# Altium schematic sheet AMP_V1.1.SchDoc
size A3; Organization: Altium Limited; Address1: L3, 12a Rodborough Rd; Address2: Frenchs Forest; Address3: NSW; Address4: Australia 2086
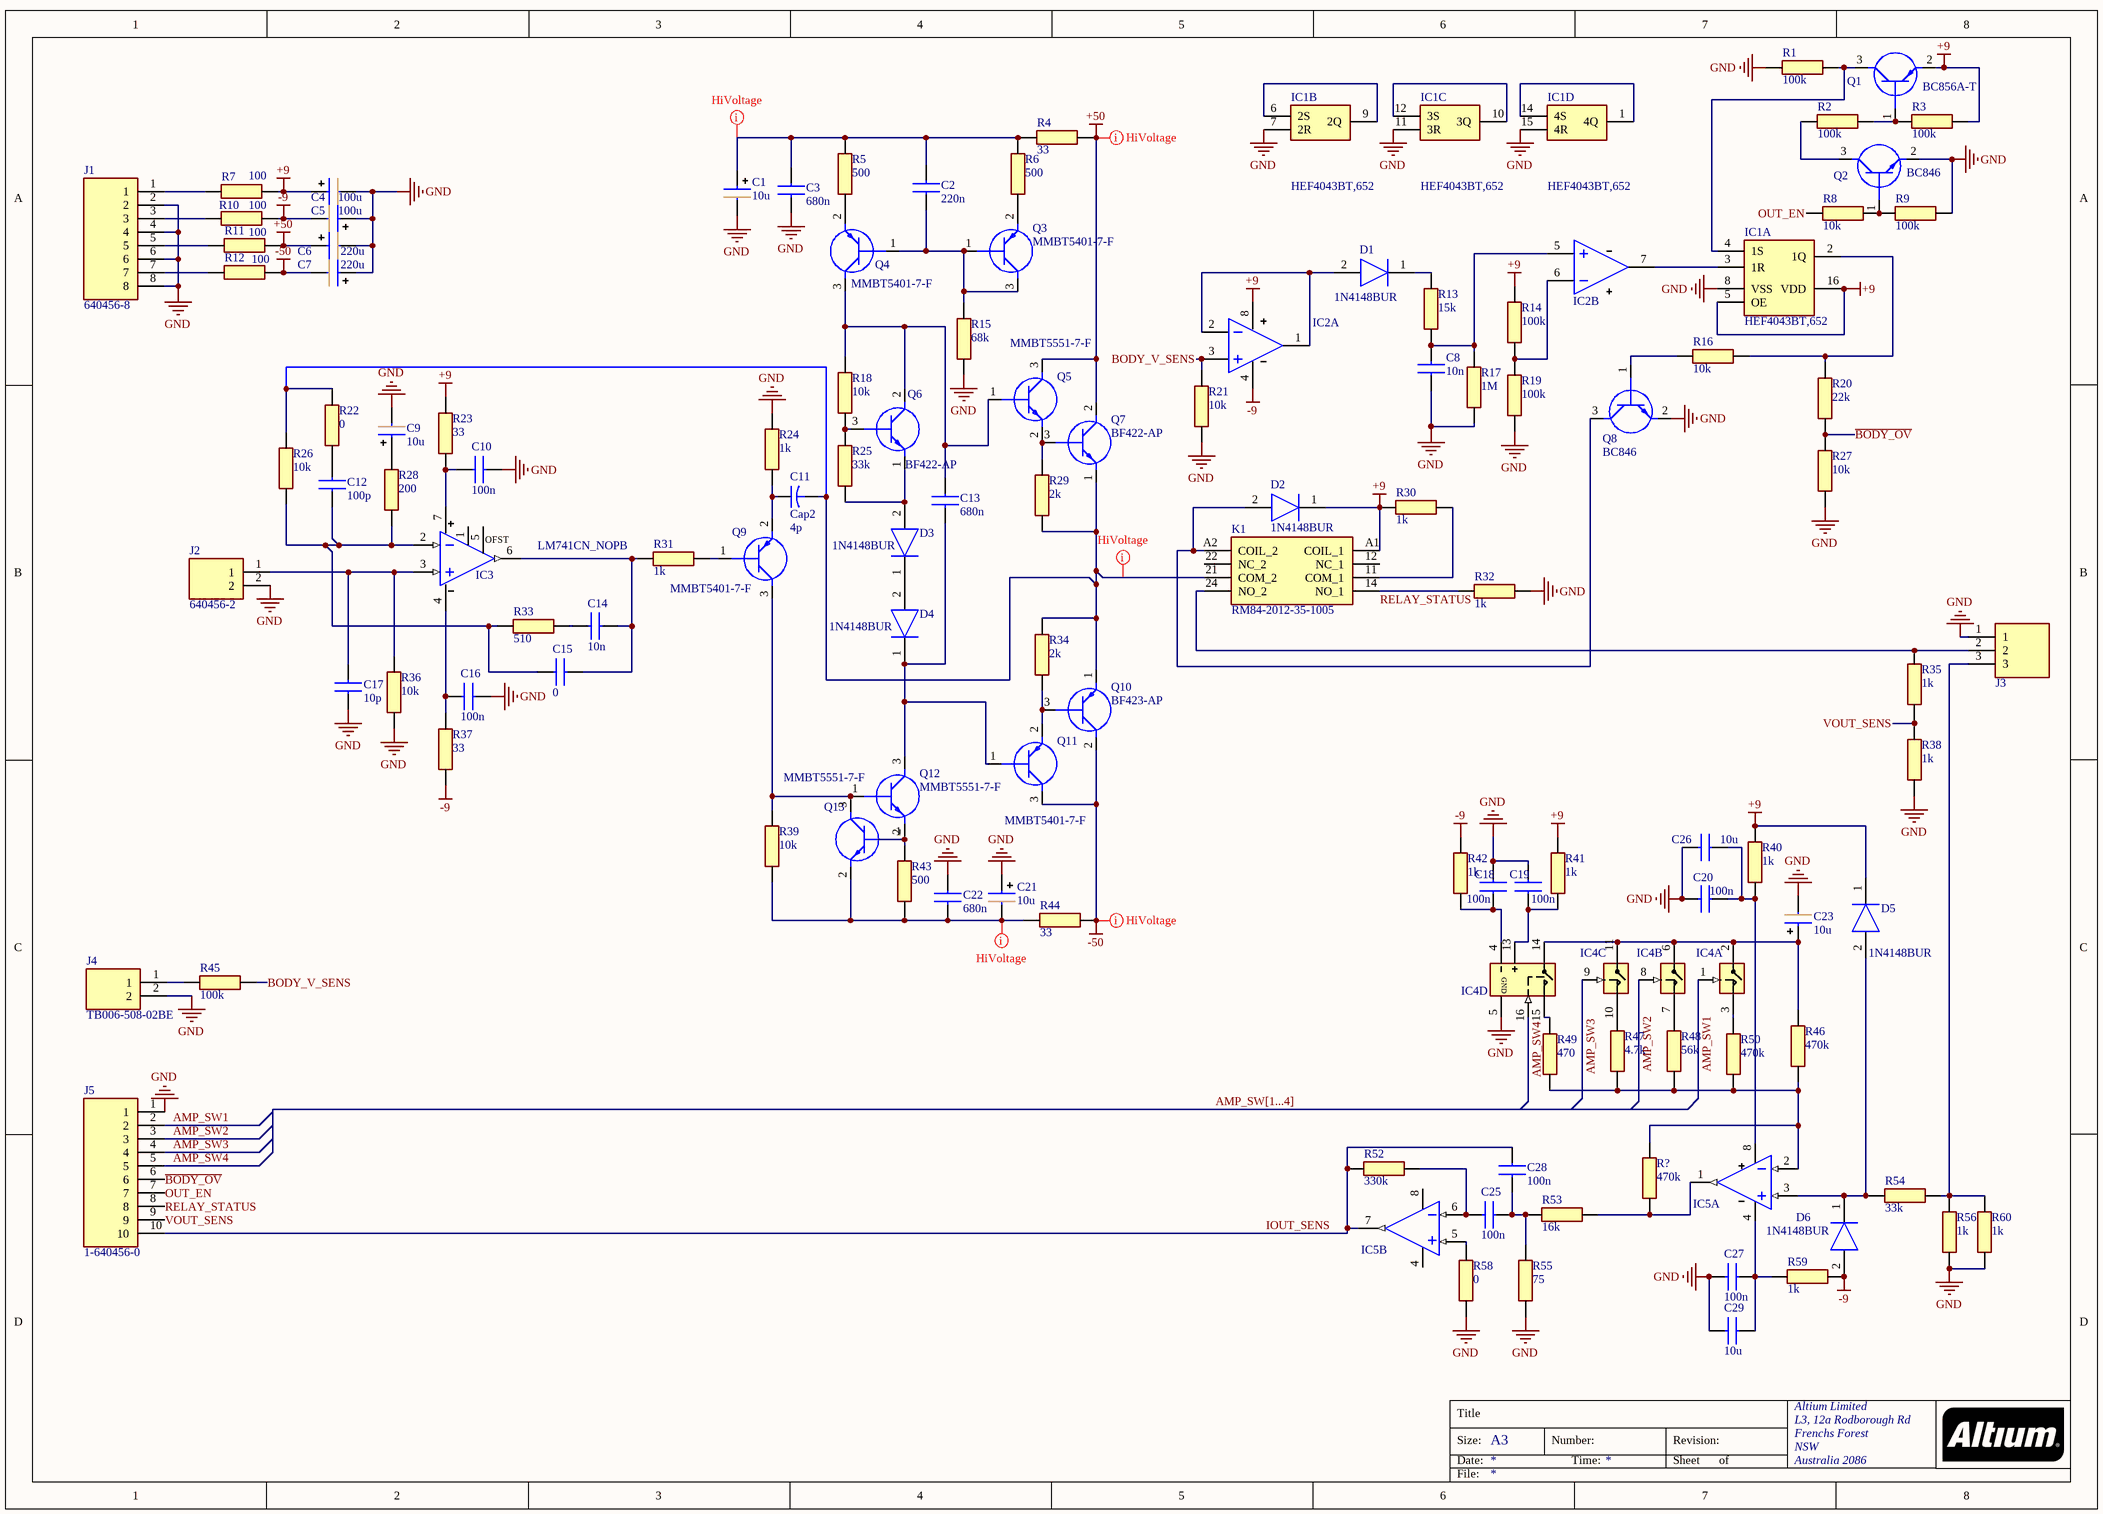
[diagram p0: AMP_V1.1.SchDoc]

## Parts
C1  value 10u  [CAP_EL_8X12R3_5]  (hidden comment: Capacitor Electrolytic)
C2  value 220n  [R82EC2470DQ60J]  (hidden comment: Capacitor Film)
C3  value 680n  [R82DC3680AA60J]  (hidden comment: Capacitor Film)
C4  value 100u  [CAP_EL_10X16XR5]  (hidden comment: Capacitor Electrolytic)
C5  value 100u  [CAP_EL_10X16XR5]  (hidden comment: Capacitor Electrolytic)
C6  value 220u  [CAP_EL_10X16XR5]  (hidden comment: Capacitor Electrolytic)
C7  value 220u  [CAP_EL_10X16XR5]  (hidden comment: Capacitor Electrolytic)
C8  value 10n  [CAPC2012X140N]  (hidden comment: Capacitor SMD)
C9  value 10u  [CAP_EL_5X7XR2]  (hidden comment: Capacitor Electrolytic)
C10  value 100n  [CAPC2012X140N]  (hidden comment: Capacitor_SMD)
C11  Cap2  value 4p  [CAPR5-4X5]
C12  value 100p  [CAPC2012X140N]  (hidden comment: Capacitor_SMD)
C13  value 680n  [R82EC2470DQ60J]  (hidden comment: Cap Polyester THT)
C14  value 10n  [CAPC2012X140N]  (hidden comment: Capacitor_SMD)
C15  value 0  [CAPC2012X140N]  (hidden comment: Capacitor_SMD)
C16  value 100n  [CAPC2012X140N]  (hidden comment: Capacitor_SMD)
C17  value 10p  [CAPC2012X140N]  (hidden comment: Capacitor_SMD)
C18  value 100n  [CAPC2012X140N]  (hidden comment: Capacitor_SMD)
C19  value 100n  [CAPC2012X140N]  (hidden comment: Capacitor_SMD)
C20  value 100n  [CAPC2012X140N]  (hidden comment: Capacitor_SMD)
C21  value 10u  [CAP_EL_8X12R3_5]  (hidden comment: Capacitor Electrolytic)
C22  value 680n  [R82DC3680AA60J]  (hidden comment: Capacitor Film)
C23  value 10u  [CAP_EL_5X7XR2]  (hidden comment: Capacitor Electrolytic)
C25  value 100n  [CAPC3216X95N]  (hidden comment: Capacitor SMD)
C26  value 10u  [CAPC2012X140N]  (hidden comment: Capacitor_SMD)
C27  value 100n  [CAPC2012X140N]  (hidden comment: Capacitor_SMD)
C28  value 100n  [CAPC3216X95N]  (hidden comment: Capacitor SMD)
C29  value 10u  [CAPC2012X140N]  (hidden comment: Capacitor_SMD)
D1  1N4148BUR  [1N4148BUR]
D2  1N4148BUR  [1N4148BUR]
D3  1N4148BUR  [1N4148BUR]
D4  1N4148BUR  [1N4148BUR]
D5  1N4148BUR  [1N4148BUR]
D6  1N4148BUR  [1N4148BUR]
IC1  HEF4043BT,652  [SOIC127P600X175-16N]  (parts A,B,C,D of 4)
IC2  LM258AWYPT  [SOIC127P600X175-8N]  (value not drawn)  (parts A,B of 2)
IC3  LM741CN_NOPB  [DIP794W53P254L959H508Q8N]
IC4  DG442DY-E3  [SOIC127P600X175-16N]  (value not drawn)  (parts A,B,C,D of 4)
IC5  AZ4580  [SOP65P490X110-8N]  (value not drawn)  (parts A,B of 2)
J1  640456-8  [SHDR8W66P0X254_1X8_2032X572X1024P]
J2  640456-2  [SHDR2W66P0X254_1X2_508X572X1041P]
J3  Terminal Block  [TB00650803BE]  (value not drawn)
J4  TB006-508-02BE  [TB00650802BE]
J5  1-640456-0  [SHDR10W66P0X254_1X10_2540X572X1041P]
K1  RM84-2012-35-1005  [RM842012351005]
Q1  BC856A-T  [SOT95P240X115-3N]
Q2  BC846  [SOT95P230X110-3N]
Q3  MMBT5401-7-F  [SOT95P240X120-3N]
Q4  MMBT5401-7-F  [SOT95P240X120-3N]
Q5  MMBT5551-7-F  [SOT96P240X110-3N]
Q6  BF422-AP  [BF422AP]
Q7  BF422-AP  [BF422AP]
Q8  BC846  [SOT95P230X110-3N]
Q9  MMBT5401-7-F  [SOT95P240X120-3N]
Q10  BF423-AP  [BF422AP]
Q11  MMBT5401-7-F  [SOT95P240X120-3N]
Q12  MMBT5551-7-F  [SOT96P240X110-3N]
Q13  MMBT5551-7-F  [SOT96P240X110-3N]
R1  value 100k  [RESC2012X60N]  (hidden comment: Res_SMD)
R2  value 100k  [RESC2012X60N]  (hidden comment: Res_SMD)
R3  value 100k  [RESC2012X60N]  (hidden comment: Res_SMD)
R4  value 33  [RESC2012X60N]  (hidden comment: Res_SMD)
R5  value 500  [RESC2012X60N]  (hidden comment: Res_SMD)
R6  value 500  [RESC2012X60N]  (hidden comment: Res_SMD)
R7  value 100  [RESC2012X60N]  (hidden comment: Res_SMD)
R8  value 10k  [RESC2012X60N]  (hidden comment: Res_SMD)
R9  value 100k  [RESC2012X60N]  (hidden comment: Res_SMD)
R10  value 100  [RESC2012X60N]  (hidden comment: Res_SMD)
R11  value 100  [RESC2012X60N]  (hidden comment: Res_SMD)
R12  value 100  [RESC2012X60N]  (hidden comment: Res_SMD)
R13  value 15k  [RESC2012X60N]  (hidden comment: Res_SMD)
R14  value 100k  [RESC2012X60N]  (hidden comment: Res_SMD)
R15  value 68k  [RESC2012X60N]  (hidden comment: Res_SMD)
R16  value 10k  [RESC2012X60N]  (hidden comment: Res_SMD)
R17  value 1M  [RESC2012X60N]  (hidden comment: Res_SMD)
R18  value 10k  [RESC2012X60N]  (hidden comment: Res_SMD)
R19  value 100k  [RESC2012X60N]  (hidden comment: Res_SMD)
R20  value 22k  [RESC2012X60N]  (hidden comment: Res_SMD)
R21  value 10k  [RESC2012X60N]  (hidden comment: Res_SMD)
R22  value 0  [RESC2012X60N]  (hidden comment: Res_SMD)
R23  value 33  [RESC2012X60N]  (hidden comment: Res_SMD)
R24  value 1k  [RESC2012X60N]  (hidden comment: Res_SMD)
R25  value 33k  [RESC2012X60N]  (hidden comment: Res_SMD)
R26  value 10k  [RESC2012X60N]  (hidden comment: Res_SMD)
R27  value 10k  [RESC2012X60N]  (hidden comment: Res_SMD)
R28  value 200  [RESC2012X60N]  (hidden comment: Res_SMD)
R29  value 2k  [RESC2012X60N]  (hidden comment: Res_SMD)
R30  value 1k  [RESC2012X60N]  (hidden comment: Res_SMD)
R31  value 1k  [RESC2012X60N]  (hidden comment: Res_SMD)
R32  value 1k  [RESC2012X60N]  (hidden comment: Res_SMD)
R33  value 510  [RESC2012X60N]  (hidden comment: Res_SMD)
R34  value 2k  [RESC2012X60N]  (hidden comment: Res_SMD)
R35  value 1k  [RESC2012X60N]  (hidden comment: Res_SMD)
R36  value 10k  [RESC2012X60N]  (hidden comment: Res_SMD)
R37  value 33  [RESC2012X60N]  (hidden comment: Res_SMD)
R38  value 1k  [RESC2012X60N]  (hidden comment: Res_SMD)
R39  value 10k  [RESC2012X60N]  (hidden comment: Res_SMD)
R40  value 1k  [RESC2012X60N]  (hidden comment: Res_SMD)
R41  value 1k  [RESC2012X60N]  (hidden comment: Res_SMD)
R42  value 1k  [RESC2012X60N]  (hidden comment: Res_SMD)
R43  value 500  [RESC2012X60N]  (hidden comment: Res_SMD)
R44  value 33  [RESC2012X60N]  (hidden comment: Res_SMD)
R45  value 100k  [RESC2012X60N]  (hidden comment: Res_SMD)
R46  value 470k  [RESC2012X60N]  (hidden comment: Res_SMD)
R47  value 4.7k  [RESC2012X60N]  (hidden comment: Res_SMD)
R48  value 56k  [RESC2012X60N]  (hidden comment: Res_SMD)
R49  value 470  [RESC2012X60N]  (hidden comment: Res_SMD)
R50  value 470k  [RESC2012X60N]  (hidden comment: Res_SMD)
R52  value 330k  [RESC2012X60N]  (hidden comment: Res_SMD)
R53  value 16k  [RESC2012X60N]  (hidden comment: Res_SMD)
R54  value 33k  [RESC2012X60N]  (hidden comment: Res_SMD)
R55  value 75  [RESC2012X60N]  (hidden comment: Res_SMD)
R56  value 1k  [RESC5025X65N]  (hidden comment: Res_SMD)
R58  value 0  [RESC2012X60N]  (hidden comment: Res_SMD)
R59  value 1k  [RESC2012X60N]  (hidden comment: Res_SMD)
R60  value 1k  [RESC5025X65N]  (hidden comment: Res_SMD)
R?  value 470k  [RESC2012X60N]  (hidden comment: Res_SMD)

## Nets
+9: C4.1(+) D2.1(K) D5.1(K) IC1.5(OE) IC1.16(VDD) IC2.8(V+) K1.A1(COIL_1) Q1.2(E) R3.2 R7.1 R14.1 R23.2 R30.1 R40.1 R41.2
+50: C6.1(+) Q5.3(C) Q7.2(C) R4.1 R11.1
-9: C5.2(-) D6.2(A) IC2.4(V-) R10.1 R37.1 R42.2 R59.2
-50: C7.2(-) Q10.2(C) Q11.3(C) R12.1 R44.1
GND: C1.2(-) C3.1 C4.2(-) C5.1(+) C6.2(-) C7.1(+) C8.2 C9.2(-) C10.2 C16.1 C17.1 C18.2 C19.2 C20.2 C21.1(+) C22.1 C23.2(-) C26.2 C27.2 C29.2 IC1.7(2R) IC1.8(VSS) IC1.11(3R) IC1.15(4R) IC4.5(GND) J1.2 J1.4 J1.6 J1.8 J2.2 J3.1 J4.2 J5.1 Q2.2(E) Q8.2(E) R1.1 R9.2 R15.1 R17.2 R19.2 R21.2 R24.2 R27.1 R32.2 R36.1 R38.2 R55.1 R56.1 R58.1 R60.1
~{BODY_OV}: J5.6 R20.1 R27.2
AMP_SW1: IC4.1(IN1) J5.2
AMP_SW2: IC4.8(IN4) J5.3
AMP_SW3: IC4.9(IN3) J5.4
AMP_SW4: IC4.16(IN2) J5.5
BODY_V_SENS: IC2.3(IN+) R21.1 R45.1
IOUT_SENS: C28.1 IC5.7(OUT) J5.10 R52.1
OUT_EN: J5.7 R8.1
RELAY_STATUS: J5.8 K1.14(NO_1) R32.1
VOUT_SENS: J5.9 R35.2 R38.1
NetC1_1: C1.1(+) C2.2 C3.2 R4.2 R5.2 R6.2
NetC2_1: C2.1 Q3.1(B) Q3.3(C) Q4.1(B) R15.2
NetC8_1: C8.1 IC2.5(IN+) R13.2 R17.1
NetC9_1: C9.1(+) R28.2
NetC10_1: C10.1 IC3.7(V-) R23.1
NetC11_1: C11.1 Q9.2(E) R24.1
NetC11_2: C11.2 K1.21(COM_2) Q7.1(E) Q10.1(E) R22.2 R26.2 R29.1 R34.2
NetC12_1: C12.1 C15.1 IC3.2(IN-) R26.1 R28.1 R33.2
NetC12_2: C12.2 R22.1
NetC13_1: C13.1 D4.1(K) Q11.1(B) Q12.3(C)
NetC13_2: C13.2 Q4.3(C) Q5.1(B) Q6.2(C) R18.2
NetC14_1: C14.1 R33.1
NetC14_2: C14.2 C15.2 IC3.6(OUT) R31.2
NetC16_2: C16.2 IC3.4(V-) R37.2
NetC17_2: C17.2 IC3.3(IN+) J2.1 R36.2
NetC18_1: C18.1 IC4.4(V-) R42.1
NetC19_1: C19.1 IC4.13(V+) R41.1
NetC20_1: C20.1 C26.1 IC5.8(V+) R40.2
NetC21_2: C21.2(-) C22.2 Q13.2(E) R39.1 R43.1 R44.2
NetC23_1: C23.1(+) IC4.2(D1) IC4.6(S4) IC4.11(S3) IC4.14(S2) R46.1
NetC25_1: C25.1 IC5.6(IN-) R52.2
NetC25_2: C25.2 C28.2 R53.2 R55.2
NetC27_1: C27.1 C29.1 IC5.4(V-) R59.1
NetD1_1: D1.1(K) R13.1
NetD1_2: D1.2(A) IC2.1(OUT) IC2.2(IN-)
NetD2_2: D2.2(A) K1.A2(COIL_2) Q8.3(C)
NetD3_1: D3.1(K) D4.2(A)
NetD3_2: D3.2(A) Q6.1(E) R25.1
NetD5_2: D5.2(A) D6.1(K) IC5.3(IN+) R54.2
NetIC1_1: IC1.1(4Q) IC1.14(4S)
NetIC1_2: IC1.2(1Q) R16.2 R20.2
NetIC1_3: IC1.3(1R) IC2.7(OUT)
NetIC1_4: IC1.4(1S) Q1.3(C) R1.2
NetIC1_6: IC1.6(2S) IC1.9(2Q)
NetIC1_10: IC1.10(3Q) IC1.12(3S)
NetIC2_6: IC2.6(IN-) R14.2 R19.1
NetIC4_3: IC4.3(S1) R50.1
NetIC4_7: IC4.7(D4) R48.1
NetIC4_10: IC4.10(D3) R47.1
NetIC4_15: IC4.15(D2) R49.1
NetIC5_1: IC5.1(OUT) R53.1 R?.2
NetIC5_2: IC5.2(IN-) R46.2 R47.2 R48.2 R49.2 R50.2 R?.1
NetIC5_5: IC5.5(IN+) R58.2
NetJ1_1: J1.1 R7.2
NetJ1_3: J1.3 R10.2
NetJ1_5: J1.5 R11.2
NetJ1_7: J1.7 R12.2
NetJ3_2: J3.2 K1.24(NO_2) R35.1
NetJ3_3: J3.3 R54.1 R56.2 R60.2
NetJ4_1: J4.1 R45.2
NetK1_11: K1.11(COM_1) R30.2
NetQ1_1: Q1.1(B) R2.2 R3.1
NetQ2_1: Q2.1(B) R8.2 R9.1
NetQ2_3: Q2.3(C) R2.1
NetQ3_2: Q3.2(E) R6.1
NetQ4_2: Q4.2(E) R5.1
NetQ5_2: Q5.2(E) Q7.3(B) R29.2
NetQ6_3: Q6.3(B) R18.1 R25.2
NetQ8_1: Q8.1(B) R16.1
NetQ9_1: Q9.1(B) R31.1
NetQ9_3: Q9.3(C) Q12.1(B) Q13.3(C) R39.2
NetQ10_3: Q10.3(B) Q11.2(E) R34.1
NetQ12_2: Q12.2(E) Q13.1(B) R43.2

Not connected (* = marked no-connect by the designer): IC3 1(V-) 5(V-); K1 12(NC_1) 22(NC_2)

## Buses and harness runs
bus AMP_SW[1...4]

## Layout directives
net class HiVoltage: +50, -50, NetC1_1, NetC11_2, NetC21_2

## Notes on the sheet
- Title
- Size:
- Date:
- A3
- Number:
- Time:
- Revision:
- Sheet
- of
- File:
- (in symbol LM741CN_NOPB) OFST

## Library data of the parts
C1 C4-C7 C9 C21 C23 = Capacitor Electrolytic: Capacitor polarized electrolytic; Manufacturer_Name: TDK; Manufacturer_Part_Number: B43640A9477M; Datasheet Link: https://componentsearchengine.com/Datasheets/1/B43640A9477M.pdf; Height: 52mm; Mouser Part Number: 871-B43640A9477M
C2 = Capacitor Film: Film polyester capacitor; Manufacturer_Name: Kemet; Manufacturer_Part_Number: R82DC3680AA60J; Datasheet Link: https://www.kemet.com/specsheet/R82DC3680AA60J; Height: 9.6mm; Mouser Part Number: 80-R82DC3680AA60J; Mouser Price/Stock: https://www.mouser.com/Search/Refine.aspx?Keyword=80-R82DC3680AA60J; Arrow Part Number: R82DC3680AA60J; Arrow Price/Stock: https://www.arrow.com/en/products/r82dc3680aa60j/kemet-corporation
C3 C22 = Capacitor Film: Film polyester capacitor; Manufacturer_Name: Kemet; Datasheet Link: https://www.kemet.com/specsheet/R82DC3680AA60J; Height: 9.6mm; Manufacturer_Part_Number: R82DC3680AA60J; Mouser Part Number: 80-R82DC3680AA60J; Mouser Price/Stock: https://www.mouser.com/Search/Refine.aspx?Keyword=80-R82DC3680AA60J; Arrow Part Number: R82DC3680AA60J; Arrow Price/Stock: https://www.arrow.com/en/products/r82dc3680aa60j/kemet-corporation
C8 C25 C28 = Capacitor SMD: Capacitor smd ceramic; Manufacturer_Name: TDK; Manufacturer_Part_Number: C3216C0G1H562J060AA; Datasheet Link: https://product.tdk.com/info/en/catalog/datasheets/mlcc_commercial_midvoltage_en.pdf; Height: 0.75mm
C10 C12 C14-C20 C26 C27 C29 = Capacitor_SMD: Capacitor smd ceramic; Manufacturer_Name: TDK; Manufacturer_Part_Number: C3216C0G1H562J060AA; Datasheet Link: https://product.tdk.com/info/en/catalog/datasheets/mlcc_commercial_midvoltage_en.pdf; Height: 0.75mm
C11 = Cap2: Capacitor; Published: 23-Sep-2002; PackageReference: CAPR5-4X5; Publisher: Altium Limited; PackageDescription: Capacitor; 2 Leads
C13 = Cap Polyester THT: Film polyester capacitor; Manufacturer_Name: Kemet; Manufacturer_Part_Number: R82DC3680AA60J; Datasheet Link: https://www.kemet.com/specsheet/R82DC3680AA60J; Height: 9.6mm; Mouser Part Number: 80-R82DC3680AA60J; Mouser Price/Stock: https://www.mouser.com/Search/Refine.aspx?Keyword=80-R82DC3680AA60J; Arrow Part Number: R82DC3680AA60J; Arrow Price/Stock: https://www.arrow.com/en/products/r82dc3680aa60j/kemet-corporation
D1-D6 = 1N4148BUR: Diode; Manufacturer_Name: Vishay; Datasheet Link: https://www.mouser.com/datasheet/2/427/ll4148-1767723.pdf; Height: 1.6mm; Manufacturer_Part_Number: 1N4148BUR; Mouser Part Number: 1n4148
IC1 = HEF4043BT,652: Integrated Circuit; Manufacturer_Name: Nexperia; Datasheet Link: https://assets.nexperia.com/documents/data-sheet/HEF4043B.pdf; Height: 1.75mm; Manufacturer_Part_Number: HEF4043BT,652; Mouser Part Number: 771-HEF4043BT652; Mouser Price/Stock: https://www.mouser.com/Search/Refine.aspx?Keyword=771-HEF4043BT652; Arrow Part Number: HEF4043BT,652; Arrow Price/Stock: https://www.arrow.com/en/products/hef4043bt652/nexperia
IC2 = LM258AWYPT: GP operational amplifier GND included; Manufacturer_Name: STMicroelectronics; Datasheet Link: https://www.st.com/resource/en/datasheet/lm158w.pdf; Height: 1.2mm; Manufacturer_Part_Number: LM258AWYPT; Mouser Part Number: 511-LM258AWYPT; Mouser Price/Stock: https://www.mouser.com/Search/Refine.aspx?Keyword=511-LM258AWYPT; Arrow Part Number: LM258AWYPT; Arrow Price/Stock: https://www.arrow.com/en/products/lm258awypt/stmicroelectronics
IC3 = LM741CN_NOPB: Integrated Circuit; Manufacturer_Name: Texas Instruments; Manufacturer_Part_Number: LM741CN/NOPB; Datasheet Link: http://docs-emea.rs-online.com/webdocs/1230/0900766b81230d6c.pdf; Height: 5.08mm; Mouser Part Number: 926-LM741CN/NOPB; Mouser Price/Stock: https://www.mouser.co.uk/ProductDetail/Texas-Instruments/LM741CN-NOPB?qs=QbsRYf82W3Gt6%252BDX6%252BuAjw%3D%3D; Arrow Part Number: LM741CN/NOPB; Arrow Price/Stock: https://www.arrow.com/en/products/lm741cnnopb/texas-instruments?region=nac
IC4 = DG442DY-E3: Integrated Circuit; Manufacturer_Name: Vishay; Datasheet Link: http://www.vishay.com/docs/70053/dg441.pdf; Height: 1.75mm; Manufacturer_Part_Number: DG442DY-E3; Mouser Part Number: 781-DG442DY-E3; Mouser Price/Stock: https://www.mouser.com/Search/Refine.aspx?Keyword=781-DG442DY-E3; Arrow Part Number: DG442DY-E3; Arrow Price/Stock: https://www.arrow.com/en/products/dg442dy-e3/vishay
IC5 = AZ4580: Operational amplifier; Arrow Part Number: AZ4580
J1 = 640456-8: Connector; Manufacturer_Name: TE Connectivity; Datasheet Link: http://docs-emea.rs-online.com/webdocs/13e2/0900766b813e2516.pdf; Height: 10.236mm; Manufacturer_Part_Number: 640456-8; Mouser Part Number: 571-6404568; Mouser Price/Stock: https://www.mouser.co.uk/ProductDetail/TE-Connectivity-AMP/640456-8?qs=%2F35zJ5USjomho1287DA4QA%3D%3D; Arrow Part Number: 640456-8; Arrow Price/Stock: https://www.arrow.com/en/products/640456-8/te-connectivity; System: Connector
J2 = 640456-2: Connector; Manufacturer_Name: TE Connectivity; Datasheet Link: http://www.te.com/commerce/DocumentDelivery/DDEController?Action=showdoc&DocId=Customer+Drawing%7F640456%7FW3%7Fpdf%7FEnglish%7FENG_CD_640456_W3.pdf%7F640456-2; Height: 10.414mm; Manufacturer_Part_Number: 640456-2; Mouser Part Number: 571-6404562; Mouser Price/Stock: https://www.mouser.co.uk/ProductDetail/TE-Connectivity-AMP/640456-2?qs=%2F35zJ5USjomRu3EJQJgZCQ%3D%3D; Arrow Part Number: 640456-2; Arrow Price/Stock: https://www.arrow.com/en/products/640456-2/te-connectivity
J3 = Terminal Block: Connector 0.2in 3PIN 1 row; Manufacturer_Name: CUI Inc.; Manufacturer_Part_Number: TB006-508-03BE; Datasheet Link: https://componentsearchengine.com/Datasheets/1/TB006-508-03BE.pdf; Height: 10.4mm; Mouser Part Number: 490-TB006-508-03BE; Mouser Price/Stock: https://www.mouser.co.uk/ProductDetail/CUI-Devices/TB006-508-03BE?qs=vLWxofP3U2zmvvLYJBQLMA%3D%3D; Arrow Part Number: TB006-508-03BE; Arrow Price/Stock: https://www.arrow.com/en/products/tb006-508-03be/cui-devices
J4 = TB006-508-02BE: Connector; Manufacturer_Name: CUI Devices; Datasheet Link: https://www.mouser.com/datasheet/2/670/tb006-508-1550645.pdf; Height: 10.4mm; Manufacturer_Part_Number: TB006-508-02BE; Arrow Part Number: TB006-508-02BE; Arrow Price/Stock: https://www.arrow.com/en/products/tb006-508-02be/cui-devices; Mouser Part Number: 490-TB006-508-02BE; Mouser Price/Stock: https://www.mouser.co.uk/ProductDetail/CUI-Devices/TB006-508-02BE?qs=vLWxofP3U2wEdOVV%2FaT04w%3D%3D
J5 = 1-640456-0: Connector; Manufacturer_Name: TE Connectivity; Datasheet Link: http://docs-emea.rs-online.com/webdocs/1570/0900766b81570371.pdf; Height: 10.414mm; Manufacturer_Part_Number: 1-640456-0; Mouser Part Number: 571-16404560; Mouser Price/Stock: https://www.mouser.co.uk/ProductDetail/TE-Connectivity-AMP/1-640456-0?qs=%2F35zJ5USjomFMMbv03PGrg%3D%3D; Arrow Part Number: 1-640456-0; Arrow Price/Stock: https://www.arrow.com/en/products/1-640456-0/te-connectivity; System: Connector
K1 = RM84-2012-35-1005: Relay or Contactor; Manufacturer_Name: Altech; Datasheet Link: https://www.tme.eu/Document/03db36903fbbe089c5f2033cc05648eb/e_RM84.pdf; Height: 15.7mm; Manufacturer_Part_Number: RM84-2012-35-1005; Mouser Part Number: 845-RM842012351005; Mouser Price/Stock: https://www.mouser.co.uk/ProductDetail/Altech/RM84-2012-35-1005?qs=tIuBKjZQlclfIDxrgB%2FiZw%3D%3D
Q1 = BC856A-T: Transistor BJT PNP; Manufacturer_Name: Rectron; Datasheet Link: https://mouser.componentsearchengine.com/Datasheets/1/BC856A-T.pdf; Height: 1.15mm; Manufacturer_Part_Number: BC856A-T; Mouser Part Number: 583-BC856A-T; Mouser Price/Stock: https://www.mouser.co.uk/ProductDetail/Rectron/BC856A-T?qs=yKhgg%2FY7bu1iKyeKV1oJ6w%3D%3D
Q2 Q8 = BC846: Transistor BJT NPN; Manufacturer_Name: Nexperia; Datasheet Link: https://assets.nexperia.com/documents/data-sheet/BC846_SER.pdf; Height: 1.1mm; Manufacturer_Part_Number: BC846; Mouser Part Number: N/A; Mouser Price/Stock: https://www.mouser.com/Search/Refine.aspx?Keyword=N%2FA
Q3 Q4 Q9 Q11 = MMBT5401-7-F: Transistor BJT PNP; Manufacturer_Name: Diodes Inc.; Datasheet Link: https://www.diodes.com/assets/Datasheets/ds30057.pdf; Height: 1.2mm; Manufacturer_Part_Number: MMBT5401-7-F; Mouser Part Number: 621-MMBT5401-F; Mouser Price/Stock: https://www.mouser.co.uk/ProductDetail/Diodes-Incorporated/MMBT5401-7-F?qs=i73nB8jq7%2FziVmdJmjed1Q%3D%3D; Arrow Part Number: MMBT5401-7-F; Arrow Price/Stock: https://www.arrow.com/en/products/mmbt5401-7-f/diodes-incorporated
Q5 Q12 Q13 = MMBT5551-7-F: Transistor BJT NPN; Manufacturer_Name: Diodes Inc.; Datasheet Link: https://componentsearchengine.com/Datasheets/2/MMBT5551-7-F.pdf; Height: 1.1mm; Manufacturer_Part_Number: MMBT5551-7-F; Mouser Part Number: 621-MMBT5551-F; Mouser Price/Stock: https://www.mouser.co.uk/ProductDetail/Diodes-Incorporated/MMBT5551-7-F?qs=CHt8fYyHClyETH%252BLCSkJww%3D%3D; Arrow Part Number: MMBT5551-7-F; Arrow Price/Stock: https://www.arrow.com/en/products/mmbt5551-7-f/diodes-incorporated
Q6 Q7 = BF422-AP: Transistor BJT NPN; Manufacturer_Name: Micro Commercial Components (MCC); Datasheet Link: https://www.arrow.com/en/products/bf422-ap/micro-commercial-components; Height: 4.7mm; Manufacturer_Part_Number: BF422-AP; Mouser Part Number: N/A; Mouser Price/Stock: https://www.mouser.co.uk/ProductDetail/Micro-Commercial-Components-MCC/BF422-AP?qs=P1JMDcb91o41C2nx90HEfA%3D%3D; Arrow Part Number: BF422-AP; Arrow Price/Stock: https://www.arrow.com/en/products/bf422-ap/micro-commercial-components
Q10 = BF423-AP: Transistor BJT PNP; Manufacturer_Name: Micro Commercial Components (MCC); Datasheet Link: https://mccsemi.com/pdf/products/BF421-BF423(TO-92).pdf; Height: 4.7mm; Manufacturer_Part_Number: BF423-AP; Mouser Part Number: N/A; Mouser Price/Stock: https://www.mouser.co.uk/ProductDetail/Micro-Commercial-Components-MCC/BF423-AP?qs=P1JMDcb91o5SLWHyd3jSDQ%3D%3D
R1-R50 R52-R56 R58-R60 R? = Res_SMD: Resistor SMD; Manufacturer_Name: Bourns; Manufacturer_Part_Number: CR1206-FW-1504ELF; Datasheet Link: http://componentsearchengine.com/Datasheets/1/CR1206-FW-1504ELF.pdf; Height: 0.75mm; Mouser Part Number: 652-CR1206FW1504ELF; Mouser Price/Stock: https://www.mouser.co.uk/ProductDetail/Bourns/CR1206-FW-1504ELF/?qs=6oMev5NRZMFfvXkOpYL2%252BA%3D%3D; Arrow Part Number: CR1206-FW-1504ELF; Arrow Price/Stock: https://www.arrow.com/en/products/cr1206-fw-1504elf/bourns